# Altium schematic sheet Power and Connectors.SchDoc: Power and Connectors
size A4; DocumentNumber: 6; SheetNumber: 6; SheetTotal: 6
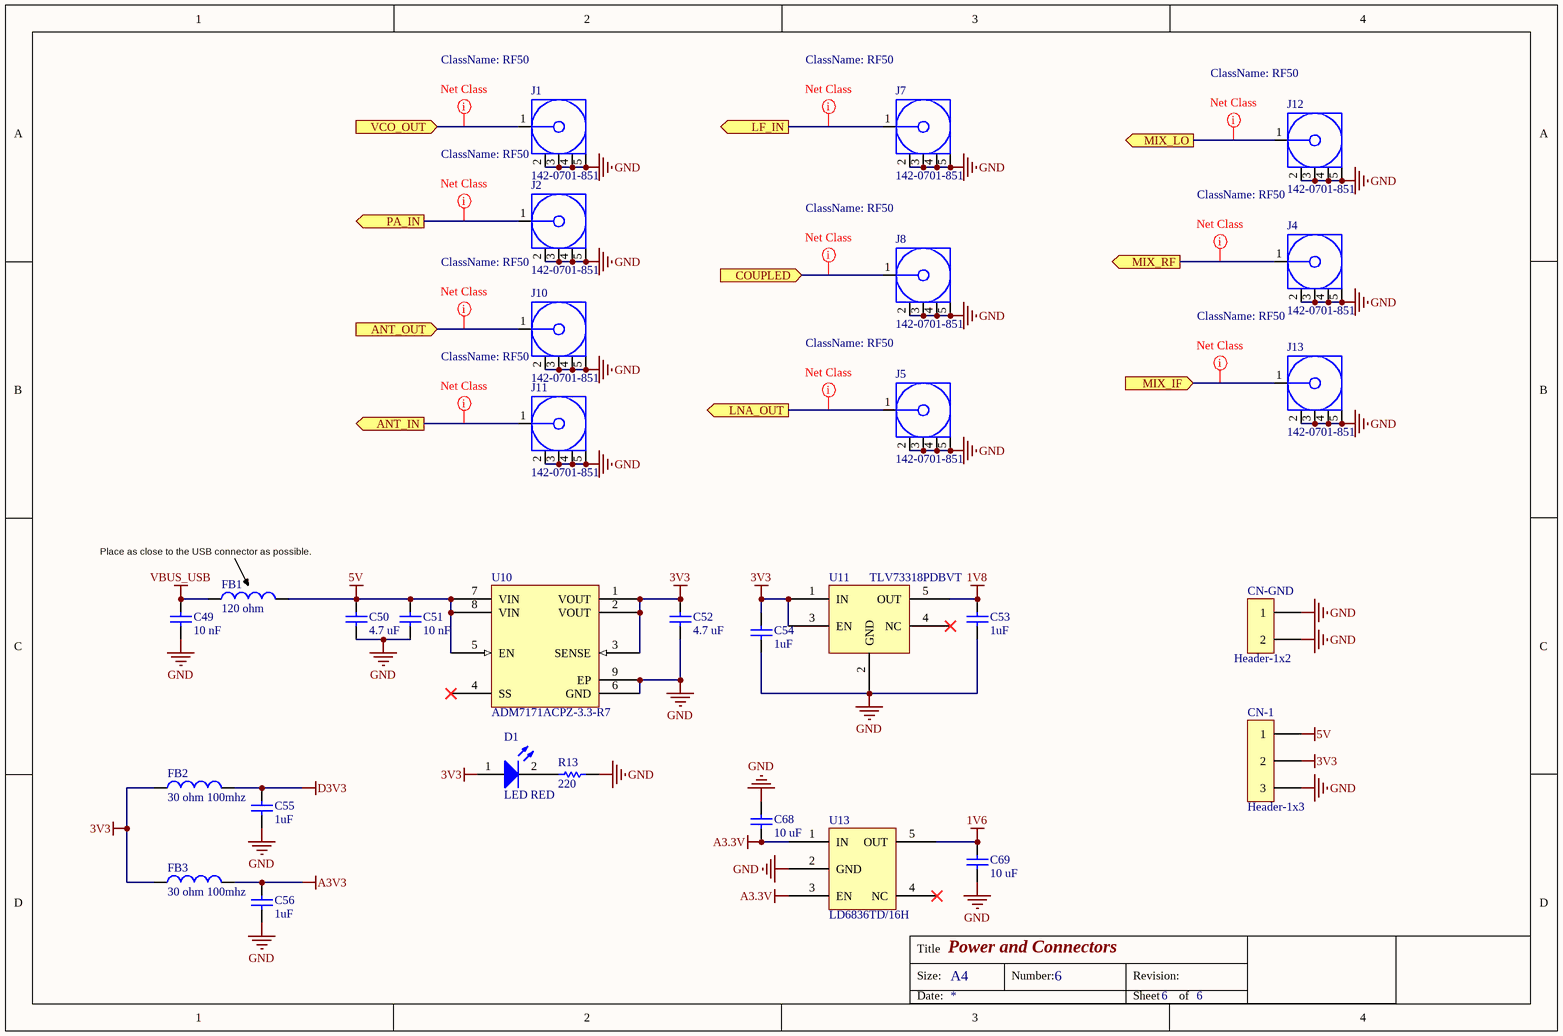
[diagram p0: Power and Connectors.SchDoc]

## Parts
C49  10 nF  [Chip2PinSM127P600-8N_CAP0402]
C50  4.7 uF  [CAPC1608X10L]
C51  10 nF  [Chip2PinSM127P600-8N_CAP0402]
C52  4.7 uF  [CAPC1608X10L]
C53  1uF  [0603 Cap]
C54  1uF  [0603 Cap]
C55  1uF  [0603 Cap]
C56  1uF  [0603 Cap]
C68  10 uF  [CAPC1608X10L]
C69  10 uF  [CAPC1608X10L]
CN-1  Header-1x3  [Header-1x3-Jumper]
CN-GND  Header-1x2  [HEADER-1x2-Jumper]
D1  LED RED  [0603 LED]
FB1  120 ohm  [INDC1608X08L]
FB2  30 ohm 100mhz  [0805 Ind]
FB3  30 ohm 100mhz  [0805 Ind]
J1  142-0701-851  [142-0701-851]
J2  142-0701-851  [142-0701-851]
J4  142-0701-851  [142-0701-851]
J5  142-0701-851  [142-0701-851]
J7  142-0701-851  [142-0701-851]
J8  142-0701-851  [142-0701-851]
J10  142-0701-851  [142-0701-851]
J11  142-0701-851  [142-0701-851]
J12  142-0701-851  [142-0701-851]
J13  142-0701-851  [142-0701-851]
R13  220  [0603 Res]
U10  ADM7171ACPZ-3.3-R7  [SON50P300X80_HS-9N LFCSP_WD Analog]
U11  TLV73318PDBVT  [SOT95P280X145-5N]
U13  LD6836TD/16H  [SOT-753]

## Ports
ANT_IN (out), ANT_OUT (in), COUPLED (in), LF_IN (out), LNA_OUT (out), MIX_IF (in), MIX_LO (out), MIX_RF (out), PA_IN (out), VCO_OUT (in)

## Nets
1V6: C69.2 U13.5(OUT)
1V8: C53.2 U11.5(OUT)
3V3: C52.2 C54.2 CN-1.2 D1.1(A) FB2.1 FB3.1 U10.1(VOUT) U10.2(VOUT) U10.3(SENSE) U11.1(IN) U11.3(EN)
5V: C50.2 C51.2 CN-1.1 FB1.2 U10.5(EN) U10.7(VIN) U10.8(VIN)
A3.3V: C68.1 U13.1(IN) U13.3(EN)
A3V3: C56.2 FB3.2
D3V3: C55.2 FB2.2
GND: C49.1 C50.1 C51.1 C52.1 C53.1 C54.1 C55.1 C56.1 C68.2 C69.1 CN-1.3 CN-GND.1 CN-GND.2 J1.2(GND) J1.3(GND) J1.4(GND) J1.5(GND) J2.2(GND) J2.3(GND) J2.4(GND) J2.5(GND) J4.2(GND) J4.3(GND) J4.4(GND) J4.5(GND) J5.2(GND) J5.3(GND) J5.4(GND) J5.5(GND) J7.2(GND) J7.3(GND) J7.4(GND) J7.5(GND) J8.2(GND) J8.3(GND) J8.4(GND) J8.5(GND) J10.2(GND) J10.3(GND) J10.4(GND) J10.5(GND) J11.2(GND) J11.3(GND) J11.4(GND) J11.5(GND) J12.2(GND) J12.3(GND) J12.4(GND) J12.5(GND) J13.2(GND) J13.3(GND) J13.4(GND) J13.5(GND) R13.2 U10.6(GND) U10.9(EP) U11.2(GND) U13.2(GND)
VBUS_USB: C49.2 FB1.1
ANT_IN: J11.1(Signal) ; port ANT_IN
ANT_OUT: J10.1(Signal) ; port ANT_OUT
COUPLED: J8.1(Signal) ; port COUPLED
LF_IN: J7.1(Signal) ; port LF_IN
LNA_OUT: J5.1(Signal) ; port LNA_OUT
MIX_IF: J13.1(Signal) ; port MIX_IF
MIX_LO: J12.1(Signal) ; port MIX_LO
MIX_RF: J4.1(Signal) ; port MIX_RF
PA_IN: J2.1(Signal) ; port PA_IN
VCO_OUT: J1.1(Signal) ; port VCO_OUT
NetD1_2: D1.2(C) R13.1

Not connected (* = marked no-connect by the designer): U10 4(SS)*; U11 4(NC)*; U13 4(NC)*

## Layout directives
net class RF50: ANT_IN, ANT_OUT, COUPLED, LF_IN, LNA_OUT, MIX_IF, MIX_LO, MIX_RF, PA_IN, VCO_OUT

## Notes on the sheet
- Place as close to the USB connector as possible.
- Title
- Size:
- A4
- Number:
- Revision:
- Date:
- Sheet
- of

## Library data of the parts
C49 C51 = CL05B103KA5NNNC: CAP CER 10000PF 25V X7R 0402; Manufacturer: Samsung Electro-Mechanics America, Inc.; Tolerance: ±10%; Supplier 1: Digi-Key; Manufacturer Part Number: CL05B103KA5NNNC; RoHS: RoHS Compliant; Category: Capacitors; Stock 1: 615673; Pricing 1: 1=0.09, 10=0.009, 25=0.006, 50=0.0044, 100=0.0037, 250=0.00308, 500=0.00266, 1000=0.00208, 5000=0.00174 (EUR); Packaging: Cut Tape (CT); Part Status: Active; Capacitance: 10000pF; Voltage - Rated: 25V; Temperature Coefficient: X7R; Operating Temperature: -55°C ~ 125°C; Features: -; Ratings: -; Applications: General Purpose; Mounting Type: Surface Mount, MLCC; Package / Case: 0402 (1005 Metric); Size / Dimension: 0.039" L x 0.020" W (1.00mm x 0.50mm); Height - Seated (Max): -; Thickness (Max): 0.022" (0.55mm); Lead Spacing: -; Lead Style: -; ComponentLink1URL: http://www.samsungsem.com/kr/support/product-search/mlcc/__icsFiles/afieldfile/2016/08/18/S_CL05B103KA5NNNC.pdf; ComponentLink1Description: http://www.samsungsem.com/kr/support/product-search/mlcc/__icsFiles/afieldfile/2016/08/18/S_CL05B103KA5NNNC.pdf; Supplier Part Number 1: 1276-1057-1-ND
C50 C52 = GRM188R61C475KAAJD: Multilayer Ceramic Capacitors MLCC - SMD/SMT 0603 4.7uF 16volts X5R + - 10%; Manufacturer: Murata Electronics; Type: General Purpose MLCC; Voltage Rating DC: 16 V; Product Status: New Product; Voltage - Rated: 16V; Supplier 1: Mouser; Manufacturer Part Number: GRM188R61C475KAAJD; RoHS: RoHS Compliant; Category: Multilayer Ceramic Capacitors MLCC - SMD/SMT; Stock 1: 10870; Pricing 1: 1=0.262, 10=0.110, 100=0.066, 1000=0.056, 4000=0.042, 8000=0.040, 24000=0.037, 48000=0.035, 100000=0.030 (EUR); Capacitance: 4.7 uF; Height: 0.8 mm; Length: 1.6 mm; Package/Case: 0603 (1608 metric); Packaging: Reel; Product: General Type MLCCs; Series: GRM; Termination Style: SMD/SMT; Tolerance: 10 %; Width: 0.8 mm; Brand: Murata Electronics; Case Code - in: 0603; Case Code - mm: 1608; Dielectric: X5R; Maximum Operating Temperature: + 85 C; Minimum Operating Temperature: - 55 C; RoHS - Mouser: Y; Minimum Order Quantity: 1; Reeling: True; ComponentLink1URL: http://www.mouser.com/ds/2/281/c02e-2905.pdf; ComponentLink1Description: http://www.mouser.com/ds/2/281/c02e-2905.pdf; Supplier 2: Digi-Key; Stock 2: 0; Pricing 2: 1=0.27, 10=0.224, 25=0.154, 50=0.1262, 100=0.112, 250=0.08404, 500=0.07424, 1000=0.06582 (EUR); Temperature Coefficient: X5R; Mounting Type: Surface Mount, MLCC; Operating Temperature: -55°C ~ 85°C; Applications: General Purpose; Ratings: -; Package / Case: 0603 (1608 Metric); Size / Dimension: 0.063" L x 0.031" W (1.60mm x 0.80mm); Height - Seated (Max): -; Thickness (Max): 0.037" (0.95mm); Lead Spacing: -; Features: -; Lead Style: -; ComponentLink2URL: http://www.murata.com/~/media/webrenewal/support/library/catalog/products/capacitor/mlcc/c02e.ashx; ComponentLink2Description: http://www.murata.com/~/media/webrenewal/support/library/catalog/products/capacitor/mlcc/c02e.ashx; Supplier Part Number 1: 81-GRM188R61C475KAJD; Supplier Part Number 2: 490-10481-1-ND
C53-C56 = CL10B105MO8NNWC: CAP CER 1UF 16V X7R 0603; Manufacturer: Samsung Electro-Mechanics America, Inc.; Capacitance: 1µF; Tolerance: ±20%; Supplier 1: Digi-Key; Manufacturer Part Number: CL10B105MO8NNWC; RoHS: RoHS Compliant; Category: Capacitors; Stock 1: 77746; Pricing 1: 1=0.09, 10=0.02, 25=0.0144, 50=0.0108, 100=0.0089, 250=0.00744, 500=0.00636, 1000=0.00499 (EUR); Packaging: Digi-Reel®; Part Status: Active; Voltage - Rated: 16V; Temperature Coefficient: X7R; Operating Temperature: -55°C ~ 125°C; Features: -; Ratings: -; Applications: General Purpose; Mounting Type: Surface Mount, MLCC; Package / Case: 0603 (1608 Metric); Size / Dimension: 0.063" L x 0.031" W (1.60mm x 0.80mm); Height - Seated (Max): -; Thickness (Max): 0.035" (0.90mm); Lead Spacing: -; Lead Style: -; ComponentLink1URL: http://www.samsungsem.com/kr/support/library/product-catalog/__icsFiles/afieldfile/2016/09/27/MLCC.pdf; ComponentLink1Description: http://www.samsungsem.com/kr/support/library/product-catalog/__icsFiles/afieldfile/2016/09/27/MLCC.pdf; Supplier Part Number 1: 1276-6524-6-ND
C68 C69 = GRM188R61C106MA73D: CAP CER 10UF 16V 20% X5R 0603; Manufacturer: Murata Electronics North America; Capacitance: 10µF; Supplier 1: Digi-Key; Supplier Part Number 1: 490-7201-1-ND; Manufacturer Part Number: GRM188R61C106MA73D; RoHS: RoHS Compliant; Category: Capacitors; Stock 1: 6341; Pricing 1: 1=0.26, 10=0.247, 25=0.212, 50=0.1802, 100=0.1731, 250=0.15544, 500=0.14838, 1000=0.12365 (EUR); Packaging: Cut Tape (CT); Tolerance: ±20%; Voltage - Rated: 16V; Temperature Coefficient: X5R; Mounting Type: Surface Mount, MLCC; Operating Temperature: -55°C ~ 85°C; Applications: General Purpose; Ratings: -; Package / Case: 0603 (1608 Metric); Size / Dimension: 0.063" L x 0.031" W (1.60mm x 0.80mm); Height - Seated (Max): -; Thickness (Max): 0.031" (0.80mm); Lead Spacing: -; Features: -; Lead Style: -; ComponentLink1URL: http://www.murata.com/~/media/webrenewal/support/library/catalog/products/capacitor/mlcc/c02e.ashx; ComponentLink1Description: http://www.murata.com/~/media/webrenewal/support/library/catalog/products/capacitor/mlcc/c02e.ashx
D1 = LTST-C191KRKT: LED RED CLEAR 0603 SMD; Manufacturer: Lite-On Inc.; Lens Color: Colorless; Millicandela Rating: 54mcd; Lens Style/Size: Rectangle with Flat Top, 1.10mm x 0.80mm; Voltage - Forward (Vf) (Typ): 2V; Current - Test: 20mA; Viewing Angle: 130°; Wavelength - Dominant: 631nm; Wavelength - Peak: 639nm; Supplier 1: Digi-Key; Manufacturer Part Number: LTST-C191KRKT; RoHS: RoHS Compliant; Category: Optoelectronics; Stock 1: 517799; Pricing 1: 1=0.27, 10=0.197, 25=0.1456, 100=0.1039, 250=0.07068, 500=0.06234, 1000=0.04884, 2500=0.0478 (EUR); Packaging: Digi-Reel®; Part Status: Active; Color: Red; Lens Transparency: Clear; Mounting Type: Surface Mount; Features: -; Package / Case: 0603 (1608 Metric); Size / Dimension: 1.60mm L x 0.80mm W; Height (Max): 0.65mm; ComponentLink1URL: http://optoelectronics.liteon.com/upload/download/DS22-2000-223/S_110_LTST-C191KRKT.pdf; ComponentLink1Description: http://optoelectronics.liteon.com/upload/download/DS22-2000-223/S_110_LTST-C191KRKT.pdf; Supplier Part Number 1: 160-1447-6-ND
FB1 = BLM18PG121SN1D: FERRITE BEAD 120 OHM 0603 1LN; Manufacturer: Murata Electronics North America; Filter Type: Power Line; Number of Lines: 1; Impedance @ Frequency: 120 Ohm @ 100MHz; Current Rating (Max): 2A; DC Resistance (DCR) (Max): 50 mOhm; Supplier 1: Digi-Key; Manufacturer Part Number: BLM18PG121SN1D; RoHS: RoHS Compliant; Category: Filters; Stock 1: 1305577; Pricing 1: 1=0.09, 10=0.067, 25=0.06, 50=0.0438, 100=0.038, 250=0.02996, 500=0.0253, 1000=0.02132 (EUR); Packaging: Cut Tape (CT); Part Status: Active; Ratings: -; Operating Temperature: -55°C ~ 125°C; Package / Case: 0603 (1608 Metric); Mounting Type: Surface Mount; Height (Max): 0.037" (0.95mm); Size / Dimension: 0.063" L x 0.031" W (1.60mm x 0.80mm); ComponentLink1URL: http://www.murata.com/en-us/products/productdata/8796738650142/ENFA0003.pdf; ComponentLink1Description: http://www.murata.com/en-us/products/productdata/8796738650142/ENFA0003.pdf; Supplier Part Number 1: 490-1037-1-ND
FB2 FB3 = MH2029-300Y: FERRITE BEAD 30 OHM 0805 1LN; Manufacturer: Bourns Inc.; Filter Type: Power, Signal Line; Number of Lines: 1; Impedance @ Frequency: 30 Ohm @ 100MHz; Current Rating (Max): 3A; DC Resistance (DCR) (Max): 25 mOhm; Supplier 1: Digi-Key; Manufacturer Part Number: MH2029-300Y; RoHS: RoHS Compliant; Category: Filters; Stock 1: 66775; Pricing 1: 1=0.09, 10=0.058, 25=0.0532, 50=0.0476, 100=0.0351, 250=0.02548, 500=0.02336, 1000=0.02017 (EUR); Packaging: Cut Tape (CT); Part Status: Active; Ratings: -; Operating Temperature: -55°C ~ 125°C; Package / Case: 0805 (2012 Metric); Mounting Type: Surface Mount; Height (Max): 0.043" (1.10mm); Size / Dimension: 0.079" L x 0.047" W (2.00mm x 1.20mm); ComponentLink1URL: http://www.bourns.com/docs/Product-Datasheets/mh.pdf; ComponentLink1Description: http://www.bourns.com/docs/Product-Datasheets/mh.pdf; Supplier Part Number 1: MH2029-300YCT-ND
J1 J2 J4 J5 J7 J8 J10-J13 = 142-0701-851: RF Connectors / Coaxial Connectors PC END MT JCK GLD .062 BOARDS TAB; Manufacturer: Johnson / Cinch Connectivity Solutions; Body Material: Brass; Body Style: Straight; Gender: Jack (Female); Impedance: 50 Ohms; RF Series: SMA; Maximum Frequency: 18 GHz; Connector Type: Jack, Female Socket; Contact Termination: Solder; Frequency - Max: 18GHz; Body Finish: Gold; Center Contact Material: Beryllium Copper; Dielectric Material: Polytetrafluoroethylene (PTFE); Voltage Rating: 335V; Supplier 1: Mouser; Supplier Part Number 1: 530-142-0701-851; Manufacturer Part Number: 142-0701-851; RoHS: RoHS Compliant; Category: RF Connectors / Coaxial Connectors; Stock 1: 21985; Pricing 1: 1=4.65, 10=4.13, 25=3.56, 100=3.09, 500=2.49, 1000=2.34 (EUR); Contact Plating: Gold; Operating Temperature Range: - 65 C to + 165 C; Orientation: Straight; Product: Connectors; Series: SMA; Termination Style: Solder; Brand: Johnson / Cinch Connectivity Solutions; Product Category: SMA Connectors; Standard Pack Qty: 5; RoHS - Mouser: Y; Minimum Order Quantity: 1; Reeling: False; ComponentLink1URL: http://emersonconnectivity.com/OA_HTML/ibeCCtpItmDspRte.jsp?item=4253264; ComponentLink1Description: http://emersonconnectivity.com/OA_HTML/ibeCCtpItmDspRte.jsp?item=4253264; Supplier 2: Digi-Key; Supplier Part Number 2: J658-ND; Stock 2: 64832; Pricing 2: 1=5.23, 10=4.656, 50=3.8012, 100=3.421, 250=3.13592, 500=2.66078, 750=2.52775, 1000=2.3757, 2500=2.28068 (EUR); Packaging: Bulk; Connector Style: SMA; Shield Termination: Solder; Mounting Type: Board Edge, End Launch; Cable Group: -; Fastening Type: Threaded; Features: -; Housing Color: Gold; Ingress Protection: -; Center Contact Plating: Gold; Operating Temperature: -65°C ~ 165°C; ComponentLink2URL: http://emersonconnectivity.com/OA_MEDIA/drawings/dr-1420701851.pdf; ComponentLink2Description: http://emersonconnectivity.com/OA_MEDIA/drawings/dr-1420701851.pdf
R13 = RC0603FR-07220RL: RES SMD 220 OHM 1% 1/10W 0603; Manufacturer: Yageo; Power (Watts): 0.1W, 1/10W; Temperature Coefficient: ±100ppm/°C; Supplier 1: Digi-Key; Manufacturer Part Number: RC0603FR-07220RL; RoHS: RoHS Compliant; Category: Resistors; Stock 1: 644291; Pricing 1: 1=0.09, 10=0.012, 25=0.0088, 50=0.0066, 100=0.0049, 250=0.00372, 500=0.00296, 1000=0.00218 (EUR); Packaging: Cut Tape (CT); Part Status: Active; Resistance (Ohms): 220; Tolerance: ±1%; Composition: Thick Film; Features: Moisture Resistant; Operating Temperature: -55°C ~ 155°C; Package / Case: 0603 (1608 Metric); Supplier Device Package: 0603; Size / Dimension: 0.063" L x 0.031" W (1.60mm x 0.80mm); Height - Seated (Max): 0.022" (0.55mm); Failure Rate: -; ComponentLink1URL: http://www.yageo.com/documents/recent/PYu-RC_Group_51_RoHS_L_7.pdf; ComponentLink1Description: http://www.yageo.com/documents/recent/PYu-RC_Group_51_RoHS_L_7.pdf; Supplier Part Number 1: 311-220HRCT-ND
U10 = ADM7171ACPZ-3.3-R7: IC REG LDO 3.3V 1A 8-LFCSP; Manufacturer: Analog Devices Inc.; Regulator Topology: Positive Fixed; Voltage - Dropout (Typical): 0.084V @ 1A; Number of Regulators: 1; Voltage - Input: Up to 6.5V; Current - Limit (Min): 1.3A; Supplier 1: Digi-Key; Manufacturer Part Number: ADM7171ACPZ-3.3-R7; RoHS: RoHS Compliant; Category: Integrated Circuits (ICs); Stock 1: 1479; Pricing 1: 1=2.96, 10=2.655, 100=2.1757, 500=1.85208 (EUR); Packaging: Cut Tape (CT); Part Status: Active; Voltage - Output: 3.3V; Current - Output: 1A; Operating Temperature: -40°C ~ 125°C; Mounting Type: Surface Mount; Package / Case: 8-WFDFN Exposed Pad, CSP; Supplier Device Package: 8-LFCSP-WD (3x3); ComponentLink1URL: http://www.analog.com/media/en/technical-documentation/data-sheets/ADM7171.pdf; ComponentLink1Description: http://www.analog.com/media/en/technical-documentation/data-sheets/ADM7171.pdf; Supplier Part Number 1: ADM7171ACPZ-3.3-R7CT-ND; .SymbolChecked: *; .FootprintChecked: *; .Critical: *
U11 = TLV73318PDBVT: IC REG LINEAR 1.8V 300MA SOT23-5; Manufacturer: Texas Instruments; Output Configuration: Positive; Output Type: Fixed; Voltage - Input (Max): 5.5V; Voltage Dropout (Max): 0.3V @ 300mA; PSRR: 68dB ~ 28dB (100Hz ~ 100kHz); Control Features: Enable; Protection Features: Over Current, Over Temperature, Short Circuit, Under Voltage Lockout (UVLO); Current - Supply: 60µA; Supplier 1: Digi-Key; Manufacturer Part Number: TLV73318PDBVT; RoHS: RoHS Compliant; Category: Integrated Circuits (ICs); Stock 1: 3652; Pricing 1: 1=0.34, 10=0.291, 100=0.2177 (EUR); Packaging: Cut Tape (CT); Part Status: Active; Voltage - Output (Min/Fixed): 1.8V; Voltage - Output (Max): -; Current - Output: 300mA; Operating Temperature: -40°C ~ 125°C; Mounting Type: Surface Mount; Package / Case: SC-74A, SOT-753; Supplier Device Package: SOT-23-5; ComponentLink1URL: http://www.ti.com/lit/ds/symlink/tlv733p.pdf; ComponentLink1Description: http://www.ti.com/lit/ds/symlink/tlv733p.pdf; Supplier Part Number 1: 296-38490-1-ND
U13 = LD6836TD/16H: NEXPERIA - LD6836TD/16H - LDO, 5,5V, 0.09VDO, 0,3A, 1,6V, 5SOT753; Tipo de Salida: Fija; Tensión de Entrada Mín.: 2.3; Tensión de Entrada Máx.: 5.5; Tensión Nominal de Salida Fija: 1.6; Corriente de Salida: 300; Tensión de Caída Vdo: 100; Núm. de Contactos Macho: 5; Temperatura de Trabajo Mín.: -40; Temperatura de Trabajo Máx.: 85; Encapsulado: Individual; Rango de Producto: 1.6V 300; Nivel de Sensibilidad a la Humedad (MSL): MSL 1 - Ilimitado; Sustancia Extremadamente Preocupante (SVHC): No SVHC (17-Dec-2015); Memory Format: DRAM; Memory Type: Volatile; Memory Size: 64Mb (4M x 16); Speed: 143MHz; Interface: Parallel; Voltage - Supply: 3 V ~ 3.6 V; Supplier 1: Farnell; Manufacturer: NEXPERIA; Manufacturer Part Number: LD6836TD/16H; RoHS: YES; Stock 1: 57; Pricing 1: 1=0,338, 40=0,273, 100=0,223, 300=0,183, 1000=0,16, 3000=0,133, 10000=0,125, 25000=0,115 (EUR); Tensión Mínima de Salida Ajustable: -; Tensión Máxima de Salida Ajustable: -; Diseño del Regulador LDO: SOT-753; Estándar de Certificación para Automoción: -; Tensión Nominal de Salida: 1.6; Voltaje de Entrada, Primario: 5.5; ComponentLink1URL: http://www.farnell.com/datasheets/1760785.pdf; ComponentLink1Description: http://www.farnell.com/datasheets/1760785.pdf; ComponentLink2URL: http://www.farnell.com/datasheets/1697991.pdf; ComponentLink2Description: http://www.farnell.com/datasheets/1697991.pdf; ComponentLink3URL: http://www.farnell.com/cad/1721740.zip; ComponentLink3Description: http://www.farnell.com/cad/1721740.zip; Supplier Part Number 1: 2308313RL; Category: Integrated Circuits (ICs); Packaging: Tray; Part Status: Active; Operating Temperature: 0°C ~ 70°C (TA); Package / Case: 54-TSOP (0.400", 10.16mm Width); Supplier Device Package: 54-TSOP II; ComponentLink4URL: http://www.issi.com/WW/pdf/42-45S16400J.pdf; ComponentLink4Description: http://www.issi.com/WW/pdf/42-45S16400J.pdf